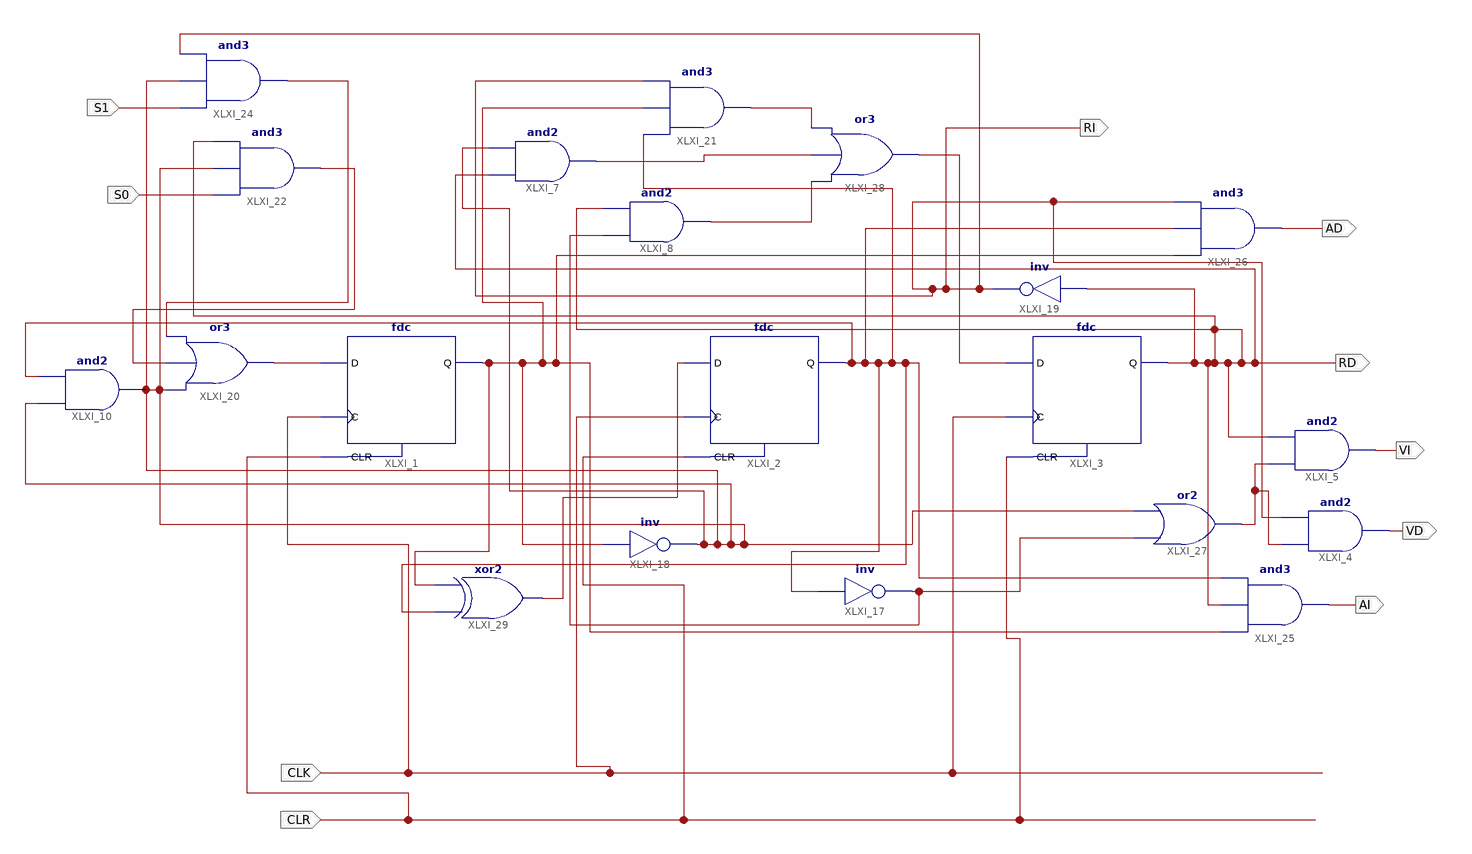
[diagram p0: schematic sheet 1]
// Xilinx ISE schematic p4ej1.sch (spartan3e) as structural Verilog: 20 symbols, 10 ports
module p4ej1 (
  input  CLK,
  input  CLR,
  input  S1,
  input  S0,
  output VI,
  output VD,
  output AD,
  output AI,
  output RD,
  output RI
);

  wire XLXN_7, XLXN_8, XLXN_34, XLXN_35, XLXN_36, XLXN_37, XLXN_38, XLXN_46, XLXN_55, XLXN_57, XLXN_59,
       XLXN_61, XLXN_63;

  fdc XLXI_1 (.C(CLK), .CLR(CLR), .D(XLXN_7), .Q(XLXN_57));
  fdc XLXI_2 (.C(CLK), .CLR(CLR), .D(XLXN_55), .Q(XLXN_63));
  fdc XLXI_3 (.C(CLK), .CLR(CLR), .D(XLXN_35), .Q(RD));
  and XLXI_4 (VD, XLXN_34, RI);
  and XLXI_5 (VI, XLXN_34, RD);
  and XLXI_7 (XLXN_37, RD, XLXN_8);
  and XLXI_8 (XLXN_38, XLXN_46, RD);
  and XLXI_10 (XLXN_8, XLXN_8, XLXN_63);
  not XLXI_17 (XLXN_46, XLXN_63);
  not XLXI_18 (XLXN_8, XLXN_57);
  not XLXI_19 (RI, RD);
  or XLXI_20 (XLXN_7, XLXN_8, XLXN_59, XLXN_61);
  and XLXI_21 (XLXN_36, XLXN_63, XLXN_57, RI);
  and XLXI_22 (XLXN_59, S0, XLXN_8, RD);
  and XLXI_24 (XLXN_61, S1, XLXN_8, RI);
  and XLXI_25 (AI, XLXN_57, RD, XLXN_63);
  and XLXI_26 (AD, XLXN_57, XLXN_63, RI);
  or XLXI_27 (XLXN_34, XLXN_46, XLXN_8);
  or XLXI_28 (XLXN_35, XLXN_38, XLXN_37, XLXN_36);
  xor XLXI_29 (XLXN_55, XLXN_63, XLXN_57);
endmodule
